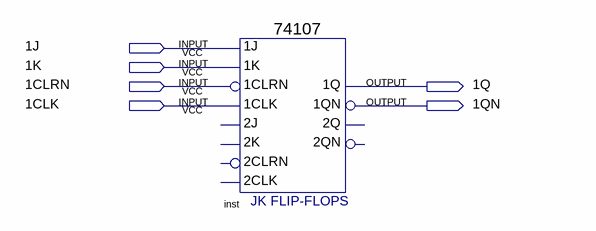
[diagram p0: schematic sheet]
// Quartus schematic exo3_3.bdf as structural Verilog: 1 symbols, 6 pins
module exo3_3 (
  input  \1J ,
  input  \1K ,
  input  \1CLRN ,
  input  \1CLK ,
  output \1Q ,
  output \1QN 
);

  \74107  inst (
    .\1CLRN (\1CLRN ), .\1K (\1K ), .\1J (\1J ), .\1CLK (\1CLK ), .\1Q (\1Q ), .\1QN (\1QN ));  // open: 2K, 2J, 2CLK, 2CLRN, 2Q, 2QN
endmodule
